# Altium schematic sheet USB Input.SchDoc
size A
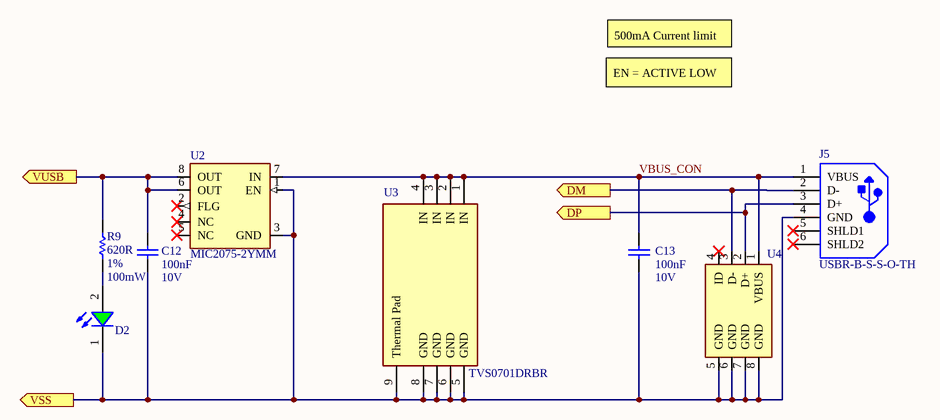
[diagram p0: USB Input.SchDoc]

## Parts
C12  Capacitance: 100nF  Voltage Rating: 10V  [0402 CAPACITOR]  (hidden comment: C0402C104K8PACTU)
C13  Capacitance: 100nF  Voltage Rating: 10V  [0402 CAPACITOR]  (hidden comment: C0402C104K8PACTU)
D2  150060VS73220  [WL-SMCC_0603_RS_VS_YS]  (value not drawn)
J5  USBR-B-S-S-O-TH  [SMTC-USBR-TH-4_V]
R9  Resistance: 620R  Tolerance: 1%  Power Rating: 100mW  [0603 RESISTOR]  (hidden comment: MCMR06X6200FTL)
U2  MIC2075-2YMM  [TSOP65P490X102-8N]
U3  TVS0701DRBR  [FP-DRB0008A-MFG]
U4  Rclamp1255P.TGT  [SON40P200X65-8N]  (value not drawn)

## Ports
DM (out), DP (out), VSS (out), VUSB (out)

## Nets
DM: J5.2(D-) U4.3(D-) ; port DM
DP: J5.3(D+) U4.2(D+) ; port DP
VBUS_CON: C13.2 J5.1(VBUS) U2.7(IN) U3.1(IN) U3.2(IN) U3.3(IN) U3.4(IN) U4.1(VBUS)
VSS: C12.1 C13.1 D2.1(K) J5.4(GND) U2.1(EN) U2.3(GND) U3.5(GND) U3.6(GND) U3.7(GND) U3.8(GND) U3.9(Thermal_Pad) U4.5(GND) U4.6(GND) U4.7(GND) U4.8(GND) ; port VSS
VUSB: C12.2 R9.2 U2.6(OUT) U2.8(OUT) ; port VUSB
NetD2_2: D2.2(A) R9.1

Not connected (* = marked no-connect by the designer): J5 5(SHLD1)* 6(SHLD2)*; U2 2(FLG)* 4(NC)* 5(NC)*; U4 4(ID)*

## Notes on the sheet
- 500mA Current limit
- EN = ACTIVE LOW

## Library data of the parts
C12 C13 = CMP-001-00061-5: Cap Ceramic 0.1uF 10V X5R 10% SMD 0402 85°C; Dissipation Factor: 5%; Number of Pins: 2; Case Code (Metric): 1005; Min Operating Temperature: -55°C; Thickness: 0.022inch; Radiation Hardening: No; Packaging: Tape and Reel; Depth: 0.5mm; Voltage: 10V; Lead Pitch: 0.3mm; Voltage Rating (DC): 10V; Mount: Surface Mount,PCB; Max Operating Temperature: 85°C; Termination: SMD/SMT; Case Code (Imperial): 0402; Width: 0.02inch; REACH SVHC: No SVHC; Contact Plating: Tin,Matte; Length: 1mm; Package Quantity: 1; Dielectric: X5R; Tolerance: 10%; Lead Free: Lead Free; Dielectric Material: Ceramic; Case/Package: 0402; Height: 0.5mm
D2 = 150060VS73220: WL-SMCC SMD Mono-color Chip LED Compact, size 0603, Bright Green, 2V, 120deg; Dominant Wavelength: 573nm; Luminous Intensity: 60mcd; Peak Wavelength: 575nm; Chip Technology: AlInGaP; ComponentLink1URL: http://www.we-online.de; ComponentLink2Description: Datasheet; ComponentLink2URL: https://katalog.we-online.com/led/datasheet/150060VS73220.pdf; Part Number: 150060VS73220; Published Date: July 2019; Publisher: Wurth Elektronik; Size: 0603; Viewing Angle: 120deg; Packaging: Tape and Reel; Emitting Color: Bright Green; Mounting Technology: SMT; Forward Voltage: 2V; Operating Temperature: -40 to +85degC
J5 = CMP-020-0000-1: Conn USB F 4 POS 2.5mm Solder RA Thru-Hole 4 Terminal 1 Port Tray; Manufacturer: SamtecInc.; Manufacturer 1: Samtec; Body Orientation: RightAngle; Rad Hard: No; Max Voltage Rating (AC): 30V; USB Standard: USB 2.0; Number of Contacts: 4; Number of Ports: 1; ComponentLink1Description: https://datasheet.ciiva.com/6743/1759611-6743744.pdf?src-supplier=Newark; Mounting Technology: ThroughHole; Datasheet URL: http://suddendocs.samtec.com/prints/usbr-b-s-x-o-th-x-mkt.pdf; Orientation: Right Angle; Length: 14.9mm; Max Operating Temperature: 85°C; Manufacturer Part Number 1: USBR-B-S-S-O-TH; ComponentLink5URL: https://datasheet.ciiva.com/3094/usb-b-3094454.pdf?src-supplier=Avnet; Package Quantity: 1; Case/Package: 4-Pin Through Hole Device, Body 16.3 x 12.04 mm, Pitch 2.5 mm; ComponentLink3URL: https://datasheet.ciiva.com/851/usbr-b-s-x-o-th-x-mkt-851782.pdf?src-supplier=Digi-Key; Manufacturer URL: http://www.samtec.com/; Min Operating Temperature: -50°C; REACH SVHC: No SVHC; Connector Type: USB; ComponentLink4Description: https://datasheet.ciiva.com/26826/getdatasheetpartid-475715-26826565.pdf?src-supplier=Verical; Depth: 16.5mm; Contact Plating: Gold; ComponentLink2URL: https://datasheet.ciiva.com/7622/452555-7622677.pdf?src-supplier=Element14; ComponentLink5Description: https://datasheet.ciiva.com/3094/usb-b-3094454.pdf?src-supplier=Avnet; Packaging: Trays; Package Reference: USBR-TH; Gender: F; Design Item ID: CMP-2000-07371-1; Number of Terminals: 4; Category: ConnectorAudioandVideo; ComponentLink1URL: https://datasheet.ciiva.com/6743/1759611-6743744.pdf?src-supplier=Newark; Pricing 1: 1=1.75000, 10=1.58800, 25=1.49040, 50=1.42560, 100=1.36080, 250=1.23120, 500=1.13400, 1000=0.97200, 2500=0.90720 (USD); Termination Method: Solder; Housing Material: Thermoplastic; Mounting: ThroughHole; Datasheet Version: Rev. J, 10/2010; ComponentLink3Description: https://datasheet.ciiva.com/851/usbr-b-s-x-o-th-x-mkt-851782.pdf?src-supplier=Digi-Key; Radiation Hardening: No; ComponentLink4URL: https://datasheet.ciiva.com/26826/getdatasheetpartid-475715-26826565.pdf?src-supplier=Verical; Pitch: 2.5mm; Source: Components - 12.06.20 - 19.51.SchLib; Mount: Through Hole,Horizontal; RoHS: Yes; Termination: Solder; Contact Material: Bronze; ComponentLink2Description: https://datasheet.ciiva.com/7622/452555-7622677.pdf?src-supplier=Element14; Type: USB; Stock 1: 4434
R9 = CMP-009-00202-2: RES, CERAMIC, 620R, 1%, 0.1W, 0603; Temperature Coefficient: 100ppm/°C; Voltage Rating: 75V; Case/Package: 0603; Case Code (Metric): 1608; Packaging: Cut Tape; REACH SVHC: No SVHC; Case Code (Imperial): 0603; Composition: Ceramic; Voltage Rating (DC): 75V
U2 = CMP-00028-00007-2: MIC2075 Series 5.5 V 140 mOhm Single-Channel Power Distribution Switch - SOIC-8; Max Output Current: 500mA; Output Configuration: High Side; Interface: On/Off; Number of Outputs: 1; Fault Protection: Over Temperature; Min Operating Temperature: -40°C; Max Operating Temperature: 85°C; Packaging: Rail/Tube; Lead Free: Lead Free
U3 = CMP-04985-000001-1: TVS ARRAYS; Manufacturer: Texas instruments; Capacitance: 77pF; Peak Pulse Current: 30A; Standoff Height: 0mm; Direction: Bidirectional; Number Of Channels: 1; Breakdown Voltage: 9.3V; Reverse Standoff Voltage: 7V; Value: 77pF; Clamping Voltage: 11V; Temperature Range Low: -40°C; Category: IC; Lead Free: Yes; Device Class L2: ESD and Circuit Protection ICs; Ambient Temperature Range High: +125°C; RoHS: TRUE; Manufacturer Part Number: TVS0701DRBR; Device Class L3: unset; Ambient Temperature Range Low: -40°C; Mouser Description: 7-V bidirectional flat-clamp surge protection device 8-SON -40 to 125; Height: 1mm; Octopart: https://octopart.com/tvs0701drbr-texas+instruments-96189204; Automotive: No; Temperature: -40°C to +125°C; ComponentLink2URL: http://www.ti.com/lit/ds/symlink/tvs0701.pdf; Device Class L1: Circuit Protection; Package: DRB0008A; Digikey Description: TVS ARRAYS; Temperature Range High: +125°C; ComponentLink2Description: Datasheet
U4 = CMP-00030-00003-1: Tvs Diode 4V 12.5V SLP2018P6; Peak Pulse Power: 40W; Power Line Protection: Yes; Min Breakdown Voltage: 4.5V; Peak Pulse Current: 3A; Number of Bidirectional Channels: 3; Reverse Standoff Voltage: 4V; Min Operating Temperature: -55°C; Clamping Voltage: 12.5V; Packaging: Tape and Reel; Mount: Surface Mount; Lead Free: Lead Free; Max Operating Temperature: 125°C